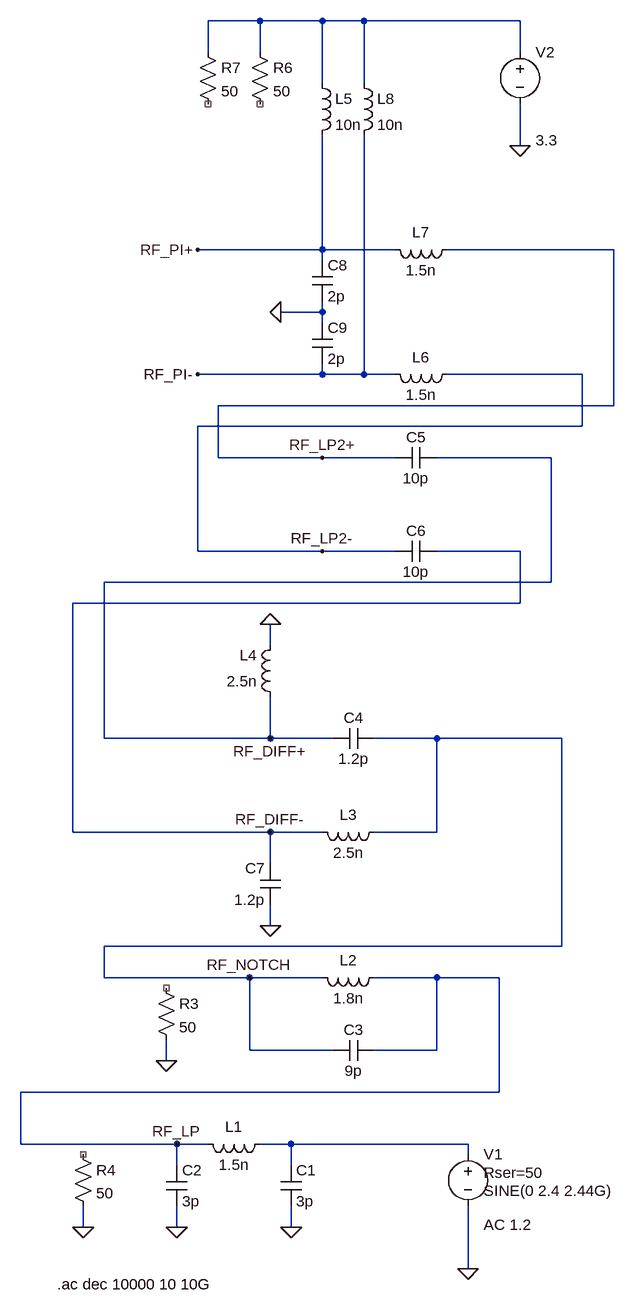
[diagram p0: schematic WIFI FrontEnd.asc]
WIFI FrontEnd.asc, the LTspice schematic file:
Version 4
SHEET 1 944 680
WIRE 272 -1616 192 -1616
WIRE 368 -1616 272 -1616
WIRE 432 -1616 368 -1616
WIRE 672 -1616 432 -1616
WIRE 192 -1568 192 -1616
WIRE 272 -1568 272 -1616
WIRE 672 -1568 672 -1616
WIRE 368 -1520 368 -1616
WIRE 432 -1520 432 -1616
WIRE 672 -1424 672 -1488
WIRE 368 -1264 368 -1440
WIRE 368 -1264 176 -1264
WIRE 480 -1264 368 -1264
WIRE 816 -1264 560 -1264
WIRE 368 -1248 368 -1264
WIRE 368 -1168 368 -1184
WIRE 368 -1168 304 -1168
WIRE 368 -1152 368 -1168
WIRE 368 -1072 368 -1088
WIRE 368 -1072 176 -1072
WIRE 432 -1072 432 -1440
WIRE 432 -1072 368 -1072
WIRE 480 -1072 432 -1072
WIRE 768 -1072 560 -1072
WIRE 816 -1024 816 -1264
WIRE 816 -1024 208 -1024
WIRE 768 -992 768 -1072
WIRE 768 -992 176 -992
WIRE 208 -944 208 -1024
WIRE 368 -944 208 -944
WIRE 480 -944 368 -944
WIRE 720 -944 544 -944
WIRE 176 -800 176 -992
WIRE 368 -800 176 -800
WIRE 480 -800 368 -800
WIRE 672 -800 544 -800
WIRE 720 -752 720 -944
WIRE 720 -752 32 -752
WIRE 672 -720 672 -800
WIRE 672 -720 -16 -720
WIRE 288 -656 288 -688
WIRE 32 -512 32 -752
WIRE 288 -512 288 -576
WIRE 288 -512 32 -512
WIRE 384 -512 288 -512
WIRE 544 -512 448 -512
WIRE 736 -512 544 -512
WIRE -16 -368 -16 -720
WIRE 288 -368 -16 -368
WIRE 368 -368 288 -368
WIRE 544 -368 544 -512
WIRE 544 -368 448 -368
WIRE 288 -320 288 -368
WIRE 288 -224 288 -256
WIRE 736 -192 736 -512
WIRE 736 -192 32 -192
WIRE 32 -144 32 -192
WIRE 256 -144 32 -144
WIRE 368 -144 256 -144
WIRE 544 -144 448 -144
WIRE 640 -144 544 -144
WIRE 256 -32 256 -144
WIRE 384 -32 256 -32
WIRE 544 -32 544 -144
WIRE 544 -32 448 -32
WIRE 128 -16 128 -48
WIRE 640 32 640 -144
WIRE 640 32 -96 32
WIRE -96 112 -96 32
WIRE 144 112 -96 112
WIRE 192 112 144 112
WIRE 320 112 272 112
WIRE 592 112 320 112
WIRE 592 128 592 112
WIRE 144 144 144 112
WIRE 320 144 320 112
WIRE 0 240 0 208
WIRE 144 240 144 208
WIRE 320 240 320 208
WIRE 592 304 592 208
FLAG 144 240 0
FLAG 320 240 0
FLAG 592 304 0
FLAG 288 -224 0
FLAG 288 -688 0
FLAG 368 -944 RF_LP2+
FLAG 368 -800 RF_LP2-
FLAG 0 240 0
FLAG 128 -16 0
FLAG 144 112 RF_LP
FLAG 256 -144 RF_NOTCH
FLAG 288 -512 RF_DIFF+
FLAG 288 -368 RF_DIFF-
FLAG 304 -1168 0
FLAG 176 -1264 RF_PI+
FLAG 176 -1072 RF_PI-
FLAG 672 -1424 0
SYMBOL cap 304 144 R0
SYMATTR InstName C1
SYMATTR Value 3p
SYMATTR SpiceLine V=25 Irms=0 Rser=0 Lser=0
SYMBOL cap 128 144 R0
SYMATTR InstName C2
SYMATTR Value 3p
SYMATTR SpiceLine V=25 Irms=0 Rser=0 Lser=0
SYMBOL ind 288 96 R90
WINDOW 0 5 56 VBottom 2
WINDOW 3 32 56 VTop 2
SYMATTR InstName L1
SYMATTR Value 1.5n
SYMATTR SpiceLine Ipk=0 Rser=0.12 Rpar=0 Cpar=0
SYMBOL cap 448 -48 R90
WINDOW 0 0 32 VBottom 2
WINDOW 3 32 32 VTop 2
SYMATTR InstName C3
SYMATTR Value 9p
SYMATTR SpiceLine V=25 Irms=0 Rser=0 Lser=0 mfg="Murata" pn="GRM0335C1E9R0CA01" type="C0G"
SYMBOL ind 464 -160 R90
WINDOW 0 5 56 VBottom 2
WINDOW 3 32 56 VTop 2
SYMATTR InstName L2
SYMATTR Value 1.8n
SYMATTR SpiceLine Rser=0.18
SYMBOL cap 448 -528 R90
WINDOW 0 0 32 VBottom 2
WINDOW 3 32 32 VTop 2
SYMATTR InstName C4
SYMATTR Value 1.2p
SYMATTR SpiceLine V=25 Irms=0 Rser=0 Lser=0 mfg="Murata" pn="GCM0335C1E1R2CA16" type="C0G"
SYMBOL cap 544 -960 R90
WINDOW 0 0 32 VBottom 2
WINDOW 3 32 32 VTop 2
SYMATTR InstName C5
SYMATTR Value 10p
SYMATTR SpiceLine V=10 Irms=0 Rser=0.4945 Lser=367p mfg="Würth Elektronik" pn="885012005007 WCAP-CSGP 0402" type="NP0"
SYMBOL cap 544 -816 R90
WINDOW 0 0 32 VBottom 2
WINDOW 3 32 32 VTop 2
SYMATTR InstName C6
SYMATTR Value 10p
SYMATTR SpiceLine V=10 Irms=0 Rser=0.4945 Lser=367p mfg="Würth Elektronik" pn="885012005007 WCAP-CSGP 0402" type="NP0"
SYMBOL cap 304 -256 R180
WINDOW 0 24 56 Left 2
WINDOW 3 24 8 Left 2
SYMATTR InstName C7
SYMATTR Value 1.2p
SYMATTR SpiceLine V=25 Irms=0 Rser=0 Lser=0 mfg="Murata" pn="GCM0335C1E1R2CA16" type="C0G"
SYMBOL ind 464 -384 R90
WINDOW 0 5 56 VBottom 2
WINDOW 3 32 56 VTop 2
SYMATTR InstName L3
SYMATTR Value 2.5n
SYMATTR SpiceLine Rser=0.2
SYMBOL ind 304 -560 R180
WINDOW 0 36 80 Left 2
WINDOW 3 36 40 Left 2
SYMATTR InstName L4
SYMATTR Value 2.5n
SYMATTR SpiceLine Rser=0.2
SYMBOL res 112 -144 R0
SYMATTR InstName R3
SYMATTR Value 50
SYMBOL res -16 112 R0
SYMATTR InstName R4
SYMATTR Value 50
SYMBOL ind 576 -1088 R90
WINDOW 0 5 56 VBottom 2
WINDOW 3 32 56 VTop 2
SYMATTR InstName L6
SYMATTR Value 1.5n
SYMATTR SpiceLine Rser=0.12
SYMBOL ind 576 -1280 R90
WINDOW 0 5 56 VBottom 2
WINDOW 3 32 56 VTop 2
SYMATTR InstName L7
SYMATTR Value 1.5n
SYMATTR SpiceLine Rser=0.12 Cpar=0
SYMBOL cap 352 -1248 R0
SYMATTR InstName C8
SYMATTR Value 2p
SYMATTR SpiceLine V=25 Irms=0 Rser=0 Lser=0 mfg="Murata" pn="GCM0335C1E2R0CA16" type="C0G"
SYMBOL cap 352 -1152 R0
SYMATTR InstName C9
SYMATTR Value 2p
SYMATTR SpiceLine V=25 Irms=0 Rser=0 Lser=0 mfg="Murata" pn="GCM0335C1E2R0CA16" type="C0G"
SYMBOL voltage 672 -1584 R0
WINDOW 123 24 124 Left 2
WINDOW 39 24 44 Left 2
WINDOW 3 24 152 Left 2
SYMATTR Value 3.3
SYMATTR InstName V2
SYMBOL ind 352 -1536 R0
SYMATTR InstName L5
SYMATTR Value 10n
SYMATTR SpiceLine Rser=0.8
SYMBOL ind 416 -1536 R0
SYMATTR InstName L8
SYMATTR Value 10n
SYMATTR SpiceLine Rser=0.8
SYMBOL res 256 -1584 R0
SYMATTR InstName R6
SYMATTR Value 50
SYMBOL res 176 -1584 R0
SYMATTR InstName R7
SYMATTR Value 50
SYMBOL voltage 592 112 R0
WINDOW 123 24 124 Left 2
WINDOW 39 24 44 Left 2
WINDOW 3 24 72 Left 2
SYMATTR Value2 AC 1.2
SYMATTR SpiceLine Rser=50
SYMATTR Value SINE(0 2.4 2.44G)
SYMATTR InstName V1
TEXT -40 328 Left 2 !.ac dec 10000 10 10G

The netlist it stands for:
* WIFI FrontEnd.asc
C1 N002 0 3p V=25 Irms=0 Rser=0 Lser=0
C2 RF_LP 0 3p V=25 Irms=0 Rser=0 Lser=0
L1 N002 RF_LP 1.5n Ipk=0 Rser=0.12 Rpar=0 Cpar=0
C3 RF_LP RF_NOTCH 9p V=25 Irms=0 Rser=0 Lser=0 mfg="Murata" pn="GRM0335C1E9R0CA01" type="C0G"
L2 RF_LP RF_NOTCH 1.8n Rser=0.18
C4 RF_NOTCH RF_DIFF+ 1.2p V=25 Irms=0 Rser=0 Lser=0 mfg="Murata" pn="GCM0335C1E1R2CA16" type="C0G"
C5 RF_DIFF+ RF_LP2+ 10p V=10 Irms=0 Rser=0.4945 Lser=367p mfg="Würth Elektronik" pn="885012005007 WCAP-CSGP 0402" type="NP0"
C6 RF_DIFF- RF_LP2- 10p V=10 Irms=0 Rser=0.4945 Lser=367p mfg="Würth Elektronik" pn="885012005007 WCAP-CSGP 0402" type="NP0"
C7 0 RF_DIFF- 1.2p V=25 Irms=0 Rser=0 Lser=0 mfg="Murata" pn="GCM0335C1E1R2CA16" type="C0G"
L3 RF_NOTCH RF_DIFF- 2.5n Rser=0.2
L4 RF_DIFF+ 0 2.5n Rser=0.2
R3 NC_01 0 50
R4 NC_02 0 50
L6 RF_LP2- RF_PI- 1.5n Rser=0.12
L7 RF_LP2+ RF_PI+ 1.5n Rser=0.12 Cpar=0
C8 RF_PI+ 0 2p V=25 Irms=0 Rser=0 Lser=0 mfg="Murata" pn="GCM0335C1E2R0CA16" type="C0G"
C9 0 RF_PI- 2p V=25 Irms=0 Rser=0 Lser=0 mfg="Murata" pn="GCM0335C1E2R0CA16" type="C0G"
V2 N001 0 3.3
L5 N001 RF_PI+ 10n Rser=0.8
L8 N001 RF_PI- 10n Rser=0.8
R6 N001 NC_03 50
R7 N001 NC_04 50
V1 N002 0 SINE(0 2.4 2.44G) AC 1.2 Rser=50
.ac dec 10000 10 10G
.backanno
.end